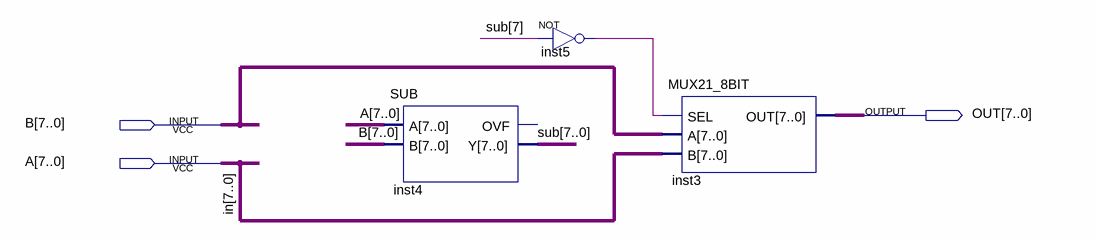
[diagram p0: schematic sheet]
// Quartus schematic MAX.bdf as structural Verilog: 3 symbols, 3 pins
module MAX (
  input  [7:0] B,
  input  [7:0] A,
  output [7:0] OUT
);

  wire inst5_out;
  wire [7:0] in, sub;

  SUB inst4 (.A(A), .B(B), .Y(sub));  // open: OVF
  not inst5 (inst5_out, sub[7]);
  MUX21_8BIT inst3 (.SEL(inst5_out), .A(B), .B(in), .OUT(OUT));
endmodule
